# EAGLE schematic Initial (EAGLE 6.5.0)
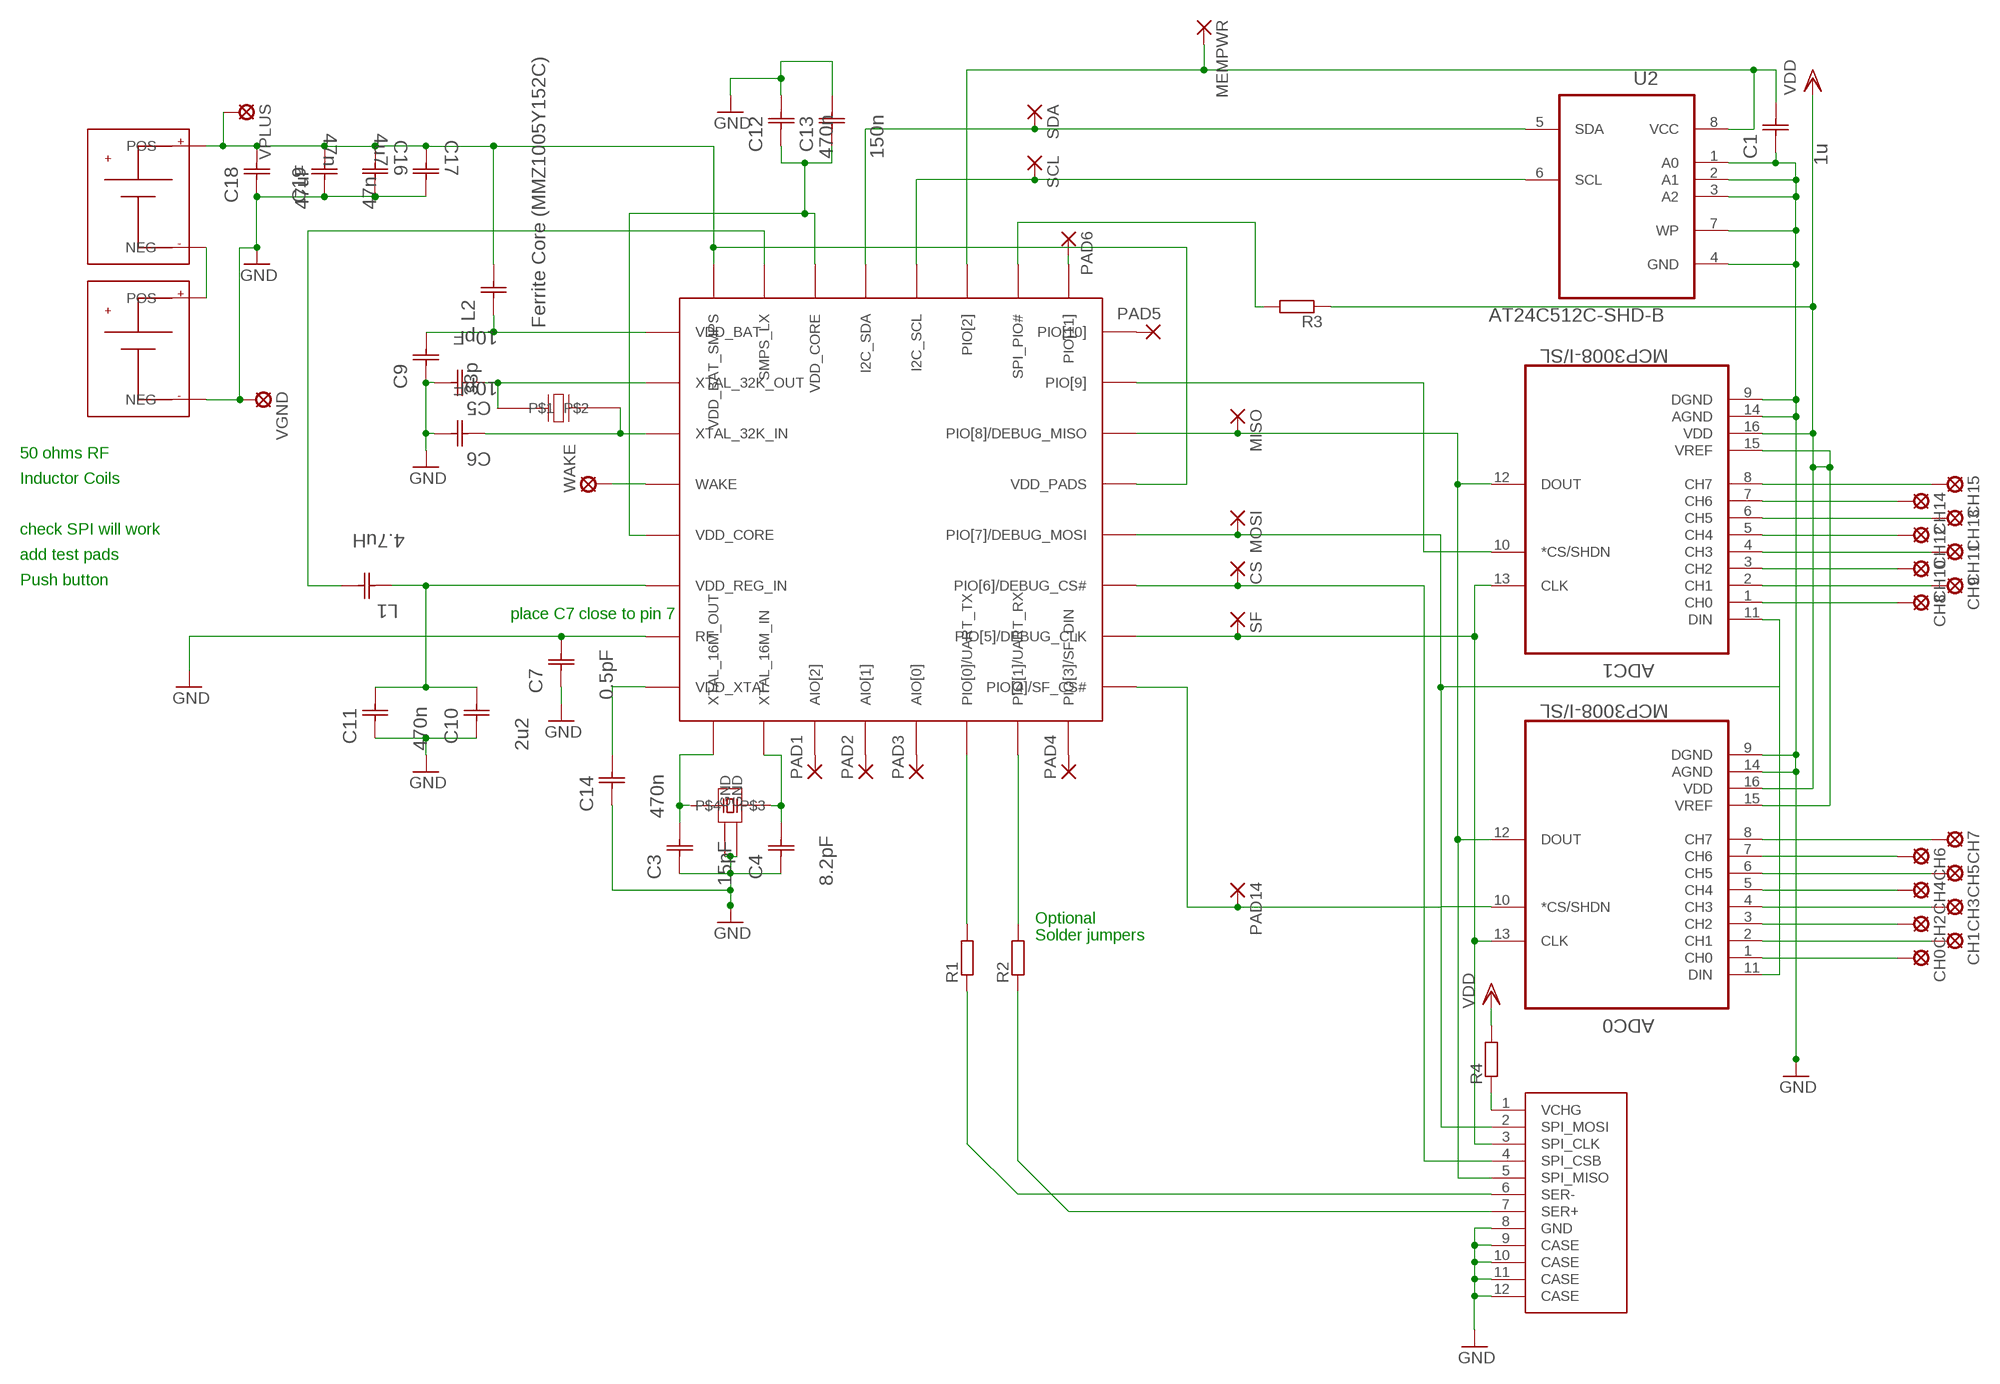
[diagram p0: schematic, sheet 1]

## Parts
ADC0  MCP3008-I/SL  [SOIC127P600X175-16N]
ADC1  MCP3008-I/SL  [SOIC127P600X175-16N]
C1  1u  UQCL2A100JAT2A/500  [CAPC1005X60N]
C3  15pF  UQCL2A150JAT2A/500  [CAPC1005X60N]
C4  8.2pF  UQCL2A8R2CAT2A/500  [CAPC1005X60N]
C5  10pF  UQCL2A100JAT2A/500  [CAPC1005X60N]
C6  10pF  UQCL2A100JAT2A/500  [CAPC1005X60N]
C7  0.5pF  UQCL2A0R5BAT2A/500  [CAPC1005X60N]
C9  33p  UQCL2A100JAT2A/500  [CAPC1005X60N]
C10  2u2  UQCL2A100JAT2A/500  [CAPC1005X60N]
C11  470n  UQCL2A100JAT2A/500  [CAPC1005X60N]
C12  470n  UQCL2A100JAT2A/500  [CAPC1005X60N]
C13  150n  UQCL2A100JAT2A/500  [CAPC1005X60N]
C14  470n  UQCL2A100JAT2A/500  [CAPC1005X60N]
C16  47n  UQCL2A1R0BAT2A/500  [CAPC1005X60N]
C17  4u7  UQCL2A1R0BAT2A/500  [CAPC1005X60N]
C18  47uF  0805AA100MAT1A  [CAPC2012X130N]
C19  47n  0805AA100MAT1A  [CAPC2012X130N]
CH0  LSP10  [LSP10]
CH1  LSP10  [LSP10]
CH2  LSP10  [LSP10]
CH3  LSP10  [LSP10]
CH4  LSP10  [LSP10]
CH5  LSP10  [LSP10]
CH6  LSP10  [LSP10]
CH7  LSP10  [LSP10]
CH8  LSP10  [LSP10]
CH9  LSP10  [LSP10]
CH10  LSP10  [LSP10]
CH11  LSP10  [LSP10]
CH12  LSP10  [LSP10]
CH13  LSP10  [LSP10]
CH14  LSP10  [LSP10]
CH15  LSP10  [LSP10]
CS  1,6/0,8  [1,6/0,8]
L1  4.7uH  12107C102JAT2A  [CAPC3225X127N]
L2  Ferrite Core (MMZ1005Y152C)  UQCL2A100JAT2A/500  [CAPC1005X60N]
MEMPWR  1,6/0,8  [1,6/0,8]
MISO  1,6/0,8  [1,6/0,8]
MOSI  1,6/0,8  [1,6/0,8]
PAD1  1,6/0,8  [1,6/0,8]
PAD2  1,6/0,8  [1,6/0,8]
PAD3  1,6/0,8  [1,6/0,8]
PAD4  1,6/0,8  [1,6/0,8]
PAD5  1,6/0,8  [1,6/0,8]
PAD6  1,6/0,8  [1,6/0,8]
PAD14  1,6/0,8  [1,6/0,8]
R1  BVS  [BVS]
R2  BVS  [BVS]
R3  BVS  [BVS]
R4  BVS  [BVS]
SCL  1,6/0,8  [1,6/0,8]
SDA  1,6/0,8  [1,6/0,8]
SF  1,6/0,8  [1,6/0,8]
U2  AT24C512C-SHD-B  [SOIC127P798X216-8N]
U$1  CSR1010A05-IQQM-R  [CSR1010A05-IQQM-R]
U$2  8PIN_SMT_CONNECTOR  [8PIN_SMT_CONNECTOR]
U$3  TSX3225  [TSX3225]
U$4  SSP-T7-F  [SSP-T7-F]
U$5  BATTERY_2996  [BATTERY_2996]
U$6  BATTERY_2996  [BATTERY_2996]
VGND  LSP10  [LSP10]
VPLUS  Vrail  LSP10  [LSP10]
WAKE  Vrail  LSP10  [LSP10]

## Nets
GND: ADC0.9(DGND) ADC0.14(AGND) ADC1.9(DGND) ADC1.14(AGND) C1.2(C1) C3.2(C1) C4.2(C1) C5.1(C2) C6.1(C2) C7.1(C2) C7.2(C1) C9.2(C1) C10.2(C1) C11.2(C1) C12.1(C2) C13.1(C2) C14.2(C1) C16.1(C2) C17.1(C2) C18.1(C1) C19.1(C1) U2.1(A0) U2.2(A1) U2.3(A2) U2.4(GND) U2.7(WP) U$1.RF U$2.8(GND) U$2.9(CASE) U$2.10(CASE) U$2.11(CASE) U$2.12(CASE) U$3.2(GND) U$3.4(GND) U$6.NEG VGND.MP
N$1: ADC0.8(CH7) CH7.MP
N$2: ADC0.7(CH6) CH6.MP
N$3: ADC0.6(CH5) CH5.MP
N$4: ADC0.5(CH4) CH4.MP
N$5: ADC0.4(CH3) CH3.MP
N$6: ADC0.3(CH2) CH2.MP
N$7: ADC0.2(CH1) CH1.MP
N$8: ADC0.1(CH0) CH0.MP
N$9: ADC1.8(CH7) CH15.MP
N$10: ADC1.7(CH6) CH14.MP
N$11: ADC1.6(CH5) CH13.MP
N$12: ADC1.5(CH4) CH12.MP
N$13: ADC1.4(CH3) CH11.MP
N$14: ADC1.3(CH2) CH10.MP
N$15: ADC1.2(CH1) CH9.MP
N$16: ADC1.1(CH0) CH8.MP
N$17: SDA.1(P) U2.5(SDA) U$1.I2C_SDA
N$18: SCL.1(P) U2.6(SCL) U$1.I2C_SCL
N$19: L1.2(C2) U$1.SMPS_LX
N$20: R1.2 U$2.6(SER-)
N$21: ADC0.13(CLK) ADC1.13(CLK) SF.1(P) U$1.PIO[5]/DEBUG_CLK U$2.3(SPI_CLK)
N$22: ADC0.12(DOUT) ADC1.12(DOUT) MISO.1(P) U$1.PIO[8]/DEBUG_MISO U$2.5(SPI_MISO)
N$23: ADC0.11(DIN) ADC1.11(DIN) MOSI.1(P) U$1.PIO[7]/DEBUG_MOSI U$2.2(SPI_MOSI)
N$24: ADC1.10(*CS/SHDN) U$1.PIO[9]
N$25: ADC0.10(*CS/SHDN) PAD14.1(P) U$1.PIO[4]/SF_CS#
N$26: C5.2(C1) U$1.XTAL_32K_OUT
N$27: C6.2(C1) U$1.XTAL_32K_IN U$4.1
N$28: C12.2(C1) C13.2(C1) U$1.VDD_CORE U$1.VDD_CORE@1(VDD_CORE)
N$29: C3.1(C2) U$1.XTAL_16M_OUT
N$30: C4.1(C2) U$1.XTAL_16M_IN
N$31: CS.1(P) U$1.PIO[6]/DEBUG_CS# U$2.4(SPI_CSB)
N$32: C9.1(C2) L2.2(C1) U$1.VDD_BAT
N$33: PAD1.1(P) U$1.AIO[2]
N$34: C16.2(C1) C17.2(C1) C18.2(C2) C19.2(C2) L2.1(C2) U$1.VDD_BAT_SMPS U$1.VDD_PADS U$5.POS@1(POS) VPLUS.MP
N$35: C14.1(C2) U$1.VDD_XTAL
N$36: R2.2 U$2.7(SER+)
N$37: R1.1 U$1.PIO[0]/UART_TX
N$38: R2.1 U$1.PIO[1]/UART_RX
N$39: C10.1(C2) C11.1(C2) L1.1(C1) U$1.VDD_REG_IN
N$40: R4.2 U$2.1(VCHG)
N$41: PAD2.1(P) U$1.AIO[1]
N$42: PAD3.1(P) U$1.AIO[0]
N$43: PAD4.1(P) U$1.PIO[3]/SF_DIN
N$44: PAD5.1(P) U$1.PIO[10]
N$45: R3.1 U$1.SPI_PIO#
N$46: C1.1(C2) MEMPWR.1(P) U$1.PIO[2]
N$47: PAD6.1(P) U$1.PIO[11]
N$48: U$5.NEG U$6.POS@1(POS)
N$49: U$1.WAKE WAKE.MP
VDD: ADC0.15(VREF) ADC0.16(VDD) ADC1.15(VREF) ADC1.16(VDD) R3.2 R4.1
Unconnected: U$3.1 U$3.3 U$4.4

## Notes on the sheet
- 50 ohms RF
- Inductor Coils
- check SPI will work
- add test pads
- Push button
- place C7 close to pin 7
- Optional
- Solder jumpers

## Power pins joined to a net without a drawn wire
VCC: U2.8(VCC)

## Library data of the parts
ADC0 ADC1 = Microchip_By_element14_Batch_1:MCP3008-I/SL: 10BIT ADC, 8 CH, SPI, SMD; MPN: MCP3008-I/SL; OC_FARNELL: 1292241; OC_NEWARK: 19C7201; PACKAGE: SOIC16; SUPPLIER: Microchip
C1 C9-C14 L2 = AVX_By_element14_Batch_1:UQCL2A100JAT2A/500: Capacitor 0402; MPN: UQCL2A100JAT2A/500; OC_FARNELL: -; OC_NEWARK: 32T8791; SUPPLIER: AVX; TOLERANCE: ±5%; VALUE: 10pF; VOLTAGERATING: 200V
C3 = AVX_By_element14_Batch_1:UQCL2A150JAT2A/500: Capacitor 0402; MPN: UQCL2A150JAT2A/500; OC_FARNELL: -; OC_NEWARK: 32T8795; SUPPLIER: AVX; TOLERANCE: ±5%; VOLTAGERATING: 200V
C4 = AVX_By_element14_Batch_1:UQCL2A8R2CAT2A/500: Capacitor 0402; MPN: UQCL2A8R2CAT2A/500; OC_FARNELL: -; OC_NEWARK: 32T8828; SUPPLIER: AVX; TOLERANCE: ±.25 pF; VOLTAGERATING: 200V
C5 C6 = AVX_By_element14_Batch_1:UQCL2A100JAT2A/500: Capacitor 0402; MPN: UQCL2A100JAT2A/500; OC_FARNELL: -; OC_NEWARK: 32T8791; SUPPLIER: AVX; TOLERANCE: ±5%; VOLTAGERATING: 200V
C7 = AVX_By_element14_Batch_1:UQCL2A0R5BAT2A/500: Capacitor 0402; MPN: UQCL2A0R5BAT2A/500; OC_FARNELL: -; OC_NEWARK: 32T8767; SUPPLIER: AVX; TOLERANCE: ±.1 pF; VOLTAGERATING: 200V
C16 C17 = AVX_By_element14_Batch_1:UQCL2A1R0BAT2A/500: Capacitor 0402; MPN: UQCL2A1R0BAT2A/500; OC_FARNELL: -; OC_NEWARK: 32T8778; SUPPLIER: AVX; TOLERANCE: ±.1 pF; VALUE: 1pF; VOLTAGERATING: 200V
C18 C19 = AVX_By_element14_Batch_1:0805AA100MAT1A: Capacitor 0805; MPN: 0805AA100MAT1A; OC_FARNELL: -; OC_NEWARK: 18M6883; SUPPLIER: AVX; TOLERANCE: ±20%; VALUE: 10pF; VOLTAGERATING: 1000V (1kV)
CH0 CH1-CH15 VGND VPLUS WAKE = solpad:LSP10: SOLDER PAD drill 1.0 mm, distributor Buerklin, 12H555
CS MEMPWR MISO MOSI PAD1-PAD6 PAD14 SCL SDA SF = wirepad:1,6/0,8: THROUGH-HOLE PAD
L1 = AVX_By_element14_Batch_1:12107C102JAT2A: Capacitor 1210; MPN: 12107C102JAT2A; OC_FARNELL: -; OC_NEWARK: 56J0850; SUPPLIER: AVX; TOLERANCE: ±5%; VALUE: 1000PF; VOLTAGERATING: 500V
R1-R4 = resistor-shunt:BVS: SMD SHUNT RESISTOR; OC_FARNELL: unknown; OC_NEWARK: unknown
U2 = ATMEL-AT24C512C-SHD-B:AT24C512C-SHD-B: EEPROM, SERIAL, 512K (64KX8), 8SOIC-Wide; MPN: AT24C512C-SHD-B; OC_FARNELL: 1972003; OC_NEWARK: 68T4124; PACKAGE: 8SOIC-Wide; SUPPLIER: ATMEL
U$1 = CSR1010A05:CSR1010A05-IQQM-R
U$2 = MINI_SMT_8_PIN_CONNECTOR:8PIN_SMT_CONNECTOR
U$3 = TSX3225:TSX3225
U$4 = SSP-T7-F:SSP-T7-F
U$5 U$6 = BATTERY_2996:BATTERY_2996